# EAGLE design LED2 (EAGLE 9.6.0)
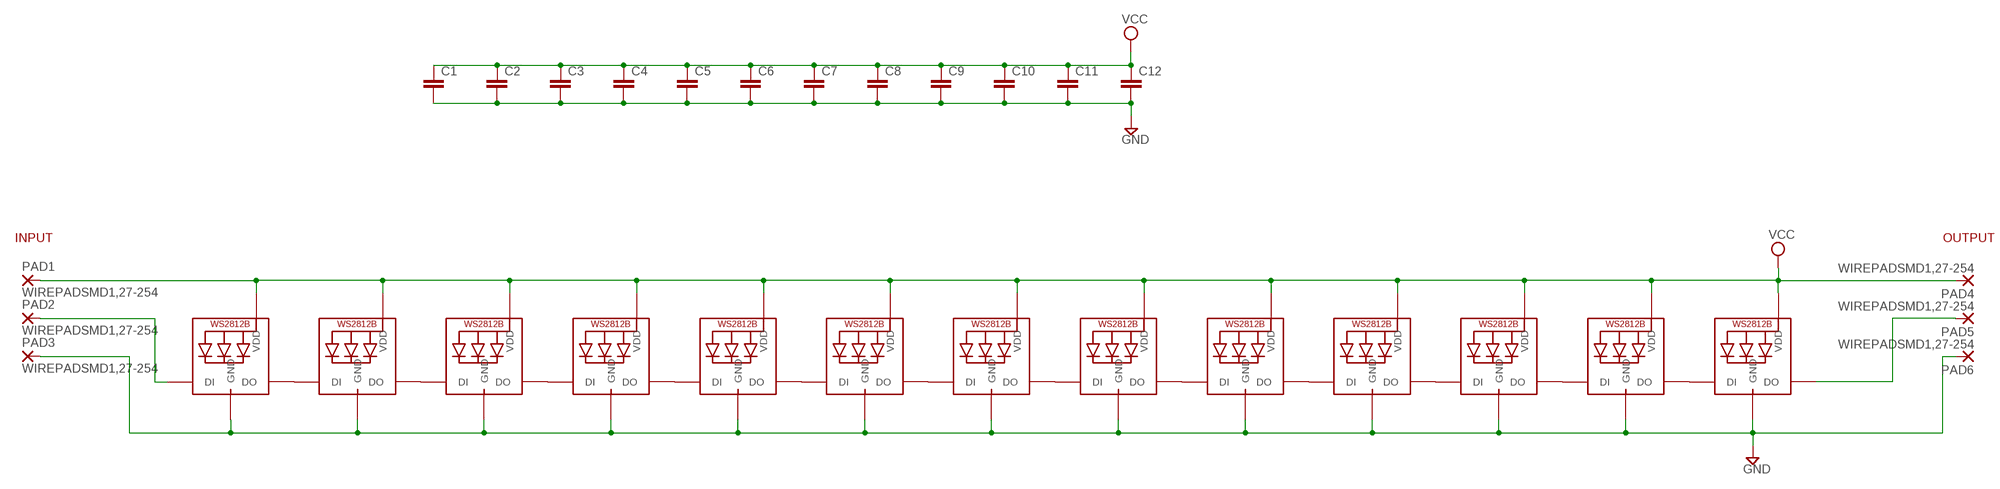
[diagram p0: schematic, sheet 1]

## Parts
C1  C-EUC0805K  [C0805K]
C2  C-EUC0805K  [C0805K]
C3  C-EUC0805K  [C0805K]
C4  C-EUC0805K  [C0805K]
C5  C-EUC0805K  [C0805K]
C6  C-EUC0805K  [C0805K]
C7  C-EUC0805K  [C0805K]
C8  C-EUC0805K  [C0805K]
C9  C-EUC0805K  [C0805K]
C10  C-EUC0805K  [C0805K]
C11  C-EUC0805K  [C0805K]
C12  C-EUC0805K  [C0805K]
LED1  WS2812B5050  [WS2812B]
LED2  WS2812B5050  [WS2812B]
LED3  WS2812B5050  [WS2812B]
LED4  WS2812B5050  [WS2812B]
LED5  WS2812B5050  [WS2812B]
LED6  WS2812B5050  [WS2812B]
LED7  WS2812B5050  [WS2812B]
LED8  WS2812B5050  [WS2812B]
LED9  WS2812B5050  [WS2812B]
LED10  WS2812B5050  [WS2812B]
LED11  WS2812B5050  [WS2812B]
LED12  WS2812B5050  [WS2812B]
LED13  WS2812B5050  [WS2812B]
PAD1  WIREPADSMD1,27-254  [SMD1,27-2,54]
PAD2  WIREPADSMD1,27-254  [SMD1,27-2,54]
PAD3  WIREPADSMD1,27-254  [SMD1,27-2,54]
PAD4  WIREPADSMD1,27-254  [SMD1,27-2,54]
PAD5  WIREPADSMD1,27-254  [SMD1,27-2,54]
PAD6  WIREPADSMD1,27-254  [SMD1,27-2,54]

## Nets
GND: C1.2 C2.2 C3.2 C4.2 C5.2 C6.2 C7.2 C8.2 C9.2 C10.2 C11.2 C12.2 LED1.3-GND(GND) LED2.3-GND(GND) LED3.3-GND(GND) LED4.3-GND(GND) LED5.3-GND(GND) LED6.3-GND(GND) LED7.3-GND(GND) LED8.3-GND(GND) LED9.3-GND(GND) LED10.3-GND(GND) LED11.3-GND(GND) LED12.3-GND(GND) LED13.3-GND(GND) PAD3.1(P) PAD6.1(P)
N$1: LED1.2-DOUT(DO) LED2.4-DIN(DI)
N$2: LED2.2-DOUT(DO) LED3.4-DIN(DI)
N$3: LED3.2-DOUT(DO) LED4.4-DIN(DI)
N$4: LED4.2-DOUT(DO) LED5.4-DIN(DI)
N$5: LED5.2-DOUT(DO) LED6.4-DIN(DI)
N$6: LED6.2-DOUT(DO) LED7.4-DIN(DI)
N$7: LED8.2-DOUT(DO) LED9.4-DIN(DI)
N$8: LED9.2-DOUT(DO) LED10.4-DIN(DI)
N$9: LED10.2-DOUT(DO) LED11.4-DIN(DI)
N$10: LED11.2-DOUT(DO) LED12.4-DIN(DI)
N$11: LED12.2-DOUT(DO) LED13.4-DIN(DI)
N$12: LED7.2-DOUT(DO) LED8.4-DIN(DI)
N$13: LED13.2-DOUT(DO) PAD5.1(P)
N$14: LED1.4-DIN(DI) PAD2.1(P)
VCC: C1.1 C2.1 C3.1 C4.1 C5.1 C6.1 C7.1 C8.1 C9.1 C10.1 C11.1 C12.1 LED1.1-VDD(VDD) LED2.1-VDD(VDD) LED3.1-VDD(VDD) LED4.1-VDD(VDD) LED5.1-VDD(VDD) LED6.1-VDD(VDD) LED7.1-VDD(VDD) LED8.1-VDD(VDD) LED9.1-VDD(VDD) LED10.1-VDD(VDD) LED11.1-VDD(VDD) LED12.1-VDD(VDD) LED13.1-VDD(VDD) PAD1.1(P) PAD4.1(P)

## Notes on the sheet
- INPUT | OUTPUT

## Library data of the parts
C1-C12 = rcl:C-EU: CAPACITOR, European symbol; SPICEPREFIX: C
LED1-LED13 = adafruit:WS2812B
PAD1-PAD6 = wirepad:WIREPAD: Wire PAD connect wire on PCB

## Board
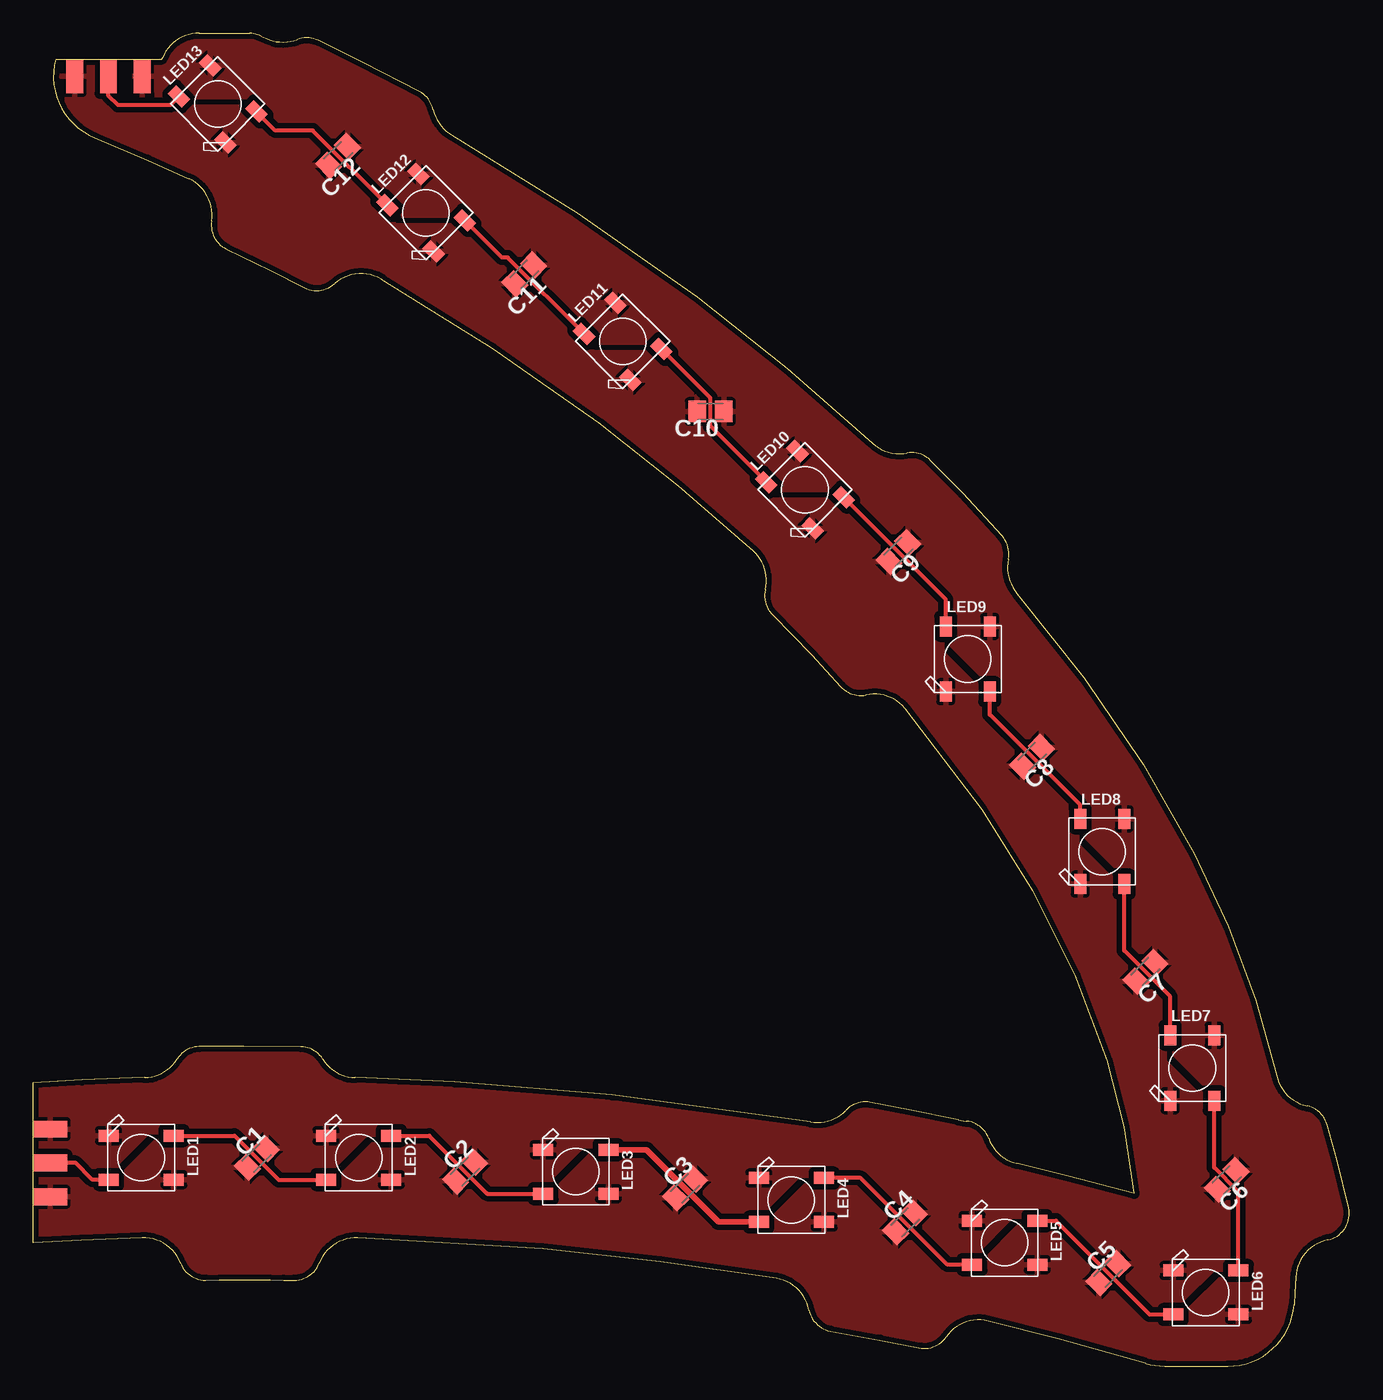
[diagram p1: board, top side]

Size 98.73 x 100 mm. Coordinates in mm from the lower left corner, seen from the top.
Outline: 83.44,0.21 76.88,2.07 71.64,3.39 arc68 68.49,2.19 arc-66 66.45,1.38 63.53,1.95 59.81,2.63 arc-69 58.2,4.21 arc69 55.75,6.58 47.05,7.84 38.26,8.79 24.35,9.64 arc71 21.45,7.73 arc-70 19.56,6.45 18.77,6.46 17.77,6.47 16.44,6.47 14.76,6.47 13.96,6.46 12.94,6.45 arc-70 11.05,7.73 arc71 8.15,9.64 3.58,9.45 0,9.24 0,21.26 3.67,21.47 8.34,21.65 arc56 10.79,23.05 arc-57 12.45,23.98 15.8,24 20.06,23.97 arc-57 21.72,23.04 arc56 24.16,21.65 27.44,21.53 31.61,21.32 43.43,20.34 58.31,18.32 arc56 60.98,19.21 arc-57 62.79,19.79 65.7,19.24 69.39,18.48 arc6 70,18.39 arc-64 71.68,17.09 arc56 73.81,15.21 77.68,14.26 82.57,12.96 81.83,17.94 80.55,22.95 78.16,29.33 74.96,35.69 71.16,41.77 65.39,49.35 arc62 62.47,50.36 arc-60 60.56,51 58.37,53.41 55.46,56.38 arc-59 54.91,58.27 arc61 54.02,61.17 48.37,66.09 42.39,70.78 34.41,76.39 26.1,81.56 arc72 22.6,81.21 arc-69 20.35,80.92 17.78,82.22 14.49,83.82 arc-73 13.37,85.92 arc74 11.67,89.09 8.57,90.49 4.62,92.16 arc-83 1.67,98.06 9.64,98.06 9.69,98.18 arc-67 12.45,100 16.23,100 arc-25 17.07,99.79 17.47,99.63 arc46 19.8,99.53 arc-46 21.37,99.47 24.75,97.81 28.99,95.62 arc-50 30,94.29 arc47 31.43,92.34 40.8,86.56 49.8,80.23 56.55,74.89 62.95,69.26 arc53 65.54,68.51 arc-55 67.32,67.96 69.73,65.49 72.69,62.27 arc-53 73.15,60.54 arc52 73.81,57.98 78.83,51.68 83.28,45.16 87.11,38.43 89.64,32.99 91.71,27.45 93.28,21.79 arc65 95.57,19.53 arc-62 97.08,18.12 97.82,15.41 98.68,11.88 arc-92 97.12,9.47 arc76 94.72,6.66 94.66,5.51 94.59,4.6 arc-85 89.61,0 84.88,0 arc-17 83.44,0.21
Copper layers (1*16): Top 0.035559375mm / dielectric 1.6mm / Bottom 0.035559375mm
Design rules "jlcpcb2layer": minimum track width 5mil, minimum drill 8mil, track to track 5mil, track to pad 5mil, pad to pad 20mil, via to via 10mil, smd to smd 5mil, copper to edge 8mil, drill to drill 20mil, minimum pad ring 12mil, minimum via ring 5mil, stop-mask expansion 2.5mil, vias tented up to drill 20mil, thermal gap 10mil

### Footprints (pad centres in the part's own frame; a part is rotated, then mirrored left to right if it is on the bottom)
C0805K = smd 1.3 x 1.6: 1 -1,0; 2 1,0
WS2812B = smd 1.5 x 0.9: 1-VDD 2.45,-1.65; 2-DOUT 2.45,1.65; 3-GND -2.45,1.65; 4-DIN -2.45,-1.65
SMD1,27-2,54 = smd 1.27 x 2.54: 1 0,0

### Placement (x,y rotation side)
C1  16.76,15.62 45 top
C2  32.38,14.61 45 top
C3  48.9,13.34 45 top
C4  65.41,10.79 45 top
C5  80.64,6.99 45 top
C6  89.53,13.97 225 top
C7  83.44,29.59 225 top
C8  74.93,45.72 225 top
C9  64.9,61.09 225 top
C10  50.8,71.63 180 top
C11  36.83,81.92 225 top
C12  22.86,90.81 225 top
LED1  8.09,15.64 0 top
LED2  24.41,15.64 0 top
LED3  40.7,14.59 0 top
LED4  56.88,12.48 0 top
LED5  72.88,9.26 0 top
LED6  87.96,5.53 0 top
LED7  86.95,22.37 90 top
LED8  80.2,38.61 90 top
LED9  70.11,53.06 90 top
LED10  57.9,65.76 135 top
LED11  44.22,76.89 135 top
LED12  29.47,86.54 135 top
LED13  13.84,94.7 135 top
PAD1  1.27,12.71 90 top
PAD2  1.27,15.25 90 top
PAD3  1.27,17.79 90 top
PAD4  8.18,96.77 0 top
PAD5  5.64,96.77 0 top
PAD6  3.1,96.77 0 top

### Tracks (layer width: path | path; a pad name or v marks a point on that pad's centre or on a via)
GND
  pour Top (isolate 0.406, rank 2): 0,21.26 0,9.24 3.58,9.45 8.15,9.64 arc-71 11.05,7.73 arc70 12.94,6.45 13.96,6.46 14.76,6.47 16.44,6.47 17.77,6.47 18.77,6.46 19.56,6.45 arc70 21.45,7.73 arc-71 24.35,9.64 38.26,8.79 47.05,7.84 55.75,6.58 arc-69 58.2,4.21 arc69 59.81,2.63 63.53,1.95 66.45,1.38 arc66 68.49,2.19 arc-68 71.64,3.39 76.88,2.07 83.44,0.21 arc17 84.88,0 89.61,0 arc85 94.59,4.6 94.66,5.51 94.72,6.66 arc-76 97.13,9.48 arc92 98.68,11.88 97.82,15.41 97.08,18.12 arc62 95.57,19.53 arc-65 93.28,21.79 91.71,27.45 89.64,32.99 87.11,38.43 83.28,45.16 78.82,51.68 73.81,57.98 arc-52 73.15,60.54 arc53 72.69,62.27 69.73,65.49 67.32,67.96 arc55 65.54,68.51 arc-53 62.95,69.26 56.55,74.89 49.8,80.23 40.8,86.56 31.43,92.34 arc-47 30,94.29 arc50 28.99,95.62 24.75,97.81 21.37,99.47 arc46 19.8,99.53 arc-46 17.47,99.63 17.12,99.79 16.67,100 12.28,100 arc67 9.7,98.29 9.55,97.93 1.74,97.93 arc88 4.1,92.41 9.12,90.25 11.67,89.09 arc-74 13.37,85.92 arc73 14.49,83.82 17.78,82.22 20.35,80.92 arc69 22.6,81.21 arc-72 26.1,81.56 34.41,76.4 42.39,70.78 48.37,66.09 54.02,61.17 arc-61 54.92,58.27 arc59 55.46,56.38 58.37,53.41 60.56,51 arc60 62.47,50.36 arc-62 65.39,49.35 71.16,41.77 74.96,35.69 78.16,29.33 80.55,22.95 81.83,17.94 82.57,12.95 77.68,14.26 73.81,15.21 arc-56 71.68,17.09 arc64 70,18.38 arc-6 69.39,18.48 65.7,19.24 62.79,19.79 arc57 60.98,19.21 arc-56 58.31,18.32 43.43,20.34 31.61,21.32 27.44,21.53 24.16,21.65 arc-56 21.72,23.04 arc57 20.06,23.97 15.8,24 12.45,23.98 arc57 10.79,23.05 arc-56 8.34,21.65 3.67,21.47
N$1
  Top 0.305: LED1.2-DOUT 15.1,17.29 18.41,13.97 21.94,13.97
  Top 0.406: 21.94,13.97 LED2.4-DIN
N$2
  Top 0.305: LED3.4-DIN 34.05,12.94 29.7,17.29 LED2.2-DOUT
N$3
  Top 0.406: LED4.4-DIN 51.41,10.82 45.99,16.24 LED3.2-DOUT
N$4
  Top 0.305: LED5.4-DIN 68.59,7.61 62.08,14.12 LED4.2-DOUT
N$5
  Top 0.305: LED5.2-DOUT 76.72,10.91 83.75,3.88 LED6.4-DIN
N$6
  Top 0.305: LED7.4-DIN 88.6,14.9 90.41,13.09 LED6.2-DOUT
N$7
  Top 0.305: LED8.2-DOUT 78.55,42.1 71.76,48.89 LED9.4-DIN
N$8
  Top 0.305: LED9.2-DOUT 68.46,57.53 LED10.4-DIN
N$9
  Top 0.305: LED10.2-DOUT 50.8,70.52 50.8,72.64 LED11.4-DIN
N$10
  Top 0.305: LED11.2-DOUT 35.59,83.19 35.15,83.19 LED12.4-DIN
N$11
  Top 0.305: LED12.2-DOUT 20.96,92.71 18.16,92.71 LED13.4-DIN
N$12
  Top 0.305: LED7.2-DOUT 85.3,27.73 81.85,31.18 LED8.4-DIN
N$13
  Top 0.305: LED13.2-DOUT 10.29,94.61 6.35,94.61 5.64,95.33 PAD5.1
N$14
  Top 0.305: LED1.4-DIN 4.42,13.99 3.17,15.24 PAD2.1
VCC
  pour Top (isolate 0.406): 7.62,95.25 15.88,95.25 18.41,92.71 20.95,92.71 27.3,86.36 32.38,86.36 41.91,76.83 46.35,76.83 50.8,72.39 50.8,70.48 55.5,65.79 60.2,65.79 68.45,57.53 68.45,54.61 71.75,51.31 71.75,48.9 78.61,42.04 78.61,40.13 81.92,36.83 81.92,31.11 85.34,27.69 85.34,23.75 88.65,20.45 88.65,14.86 90.42,13.08 90.42,7.24 89.79,7.24 86.36,3.81 83.82,3.81 76.83,10.79 74.3,10.79 71.12,7.62 68.58,7.62 62.23,13.97 58.42,13.97 55.24,10.79 51.44,10.79 45.97,16.26 42.29,16.26 38.99,12.95 34.04,12.95 29.84,17.14 26.04,17.14 22.86,13.97 18.41,13.97 15.24,17.14 9.53,17.14 6.35,13.97 0,13.97 0,-2.54 106.05,-2.54 109.86,-6.35 109.86,53.34 55.24,107.95 8.26,107.95 8.26,99.69 7.62,99.06

### Text on the board
tTest: GND | DOUT | 5V | GND | DIN | 5V